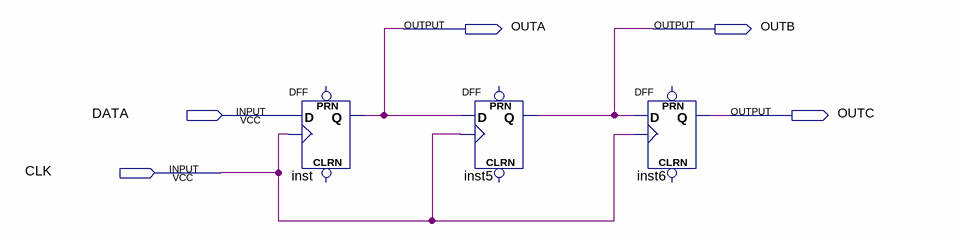
[diagram p0: schematic sheet]
// Quartus schematic ex2dflipflop.bdf as structural Verilog: 3 symbols, 5 pins
module ex2dflipflop (
  input  DATA,
  input  CLK,
  output OUTA,
  output OUTB,
  output OUTC
);

  DFF inst (.CLK(CLK), .D(DATA), .Q(OUTA));  // open: CLRN, PRN
  DFF inst5 (.CLK(CLK), .D(OUTA), .Q(OUTB));  // open: CLRN, PRN
  DFF inst6 (.CLK(CLK), .D(OUTB), .Q(OUTC));  // open: CLRN, PRN
endmodule
